# EAGLE design RFBee (EAGLE 5.07)
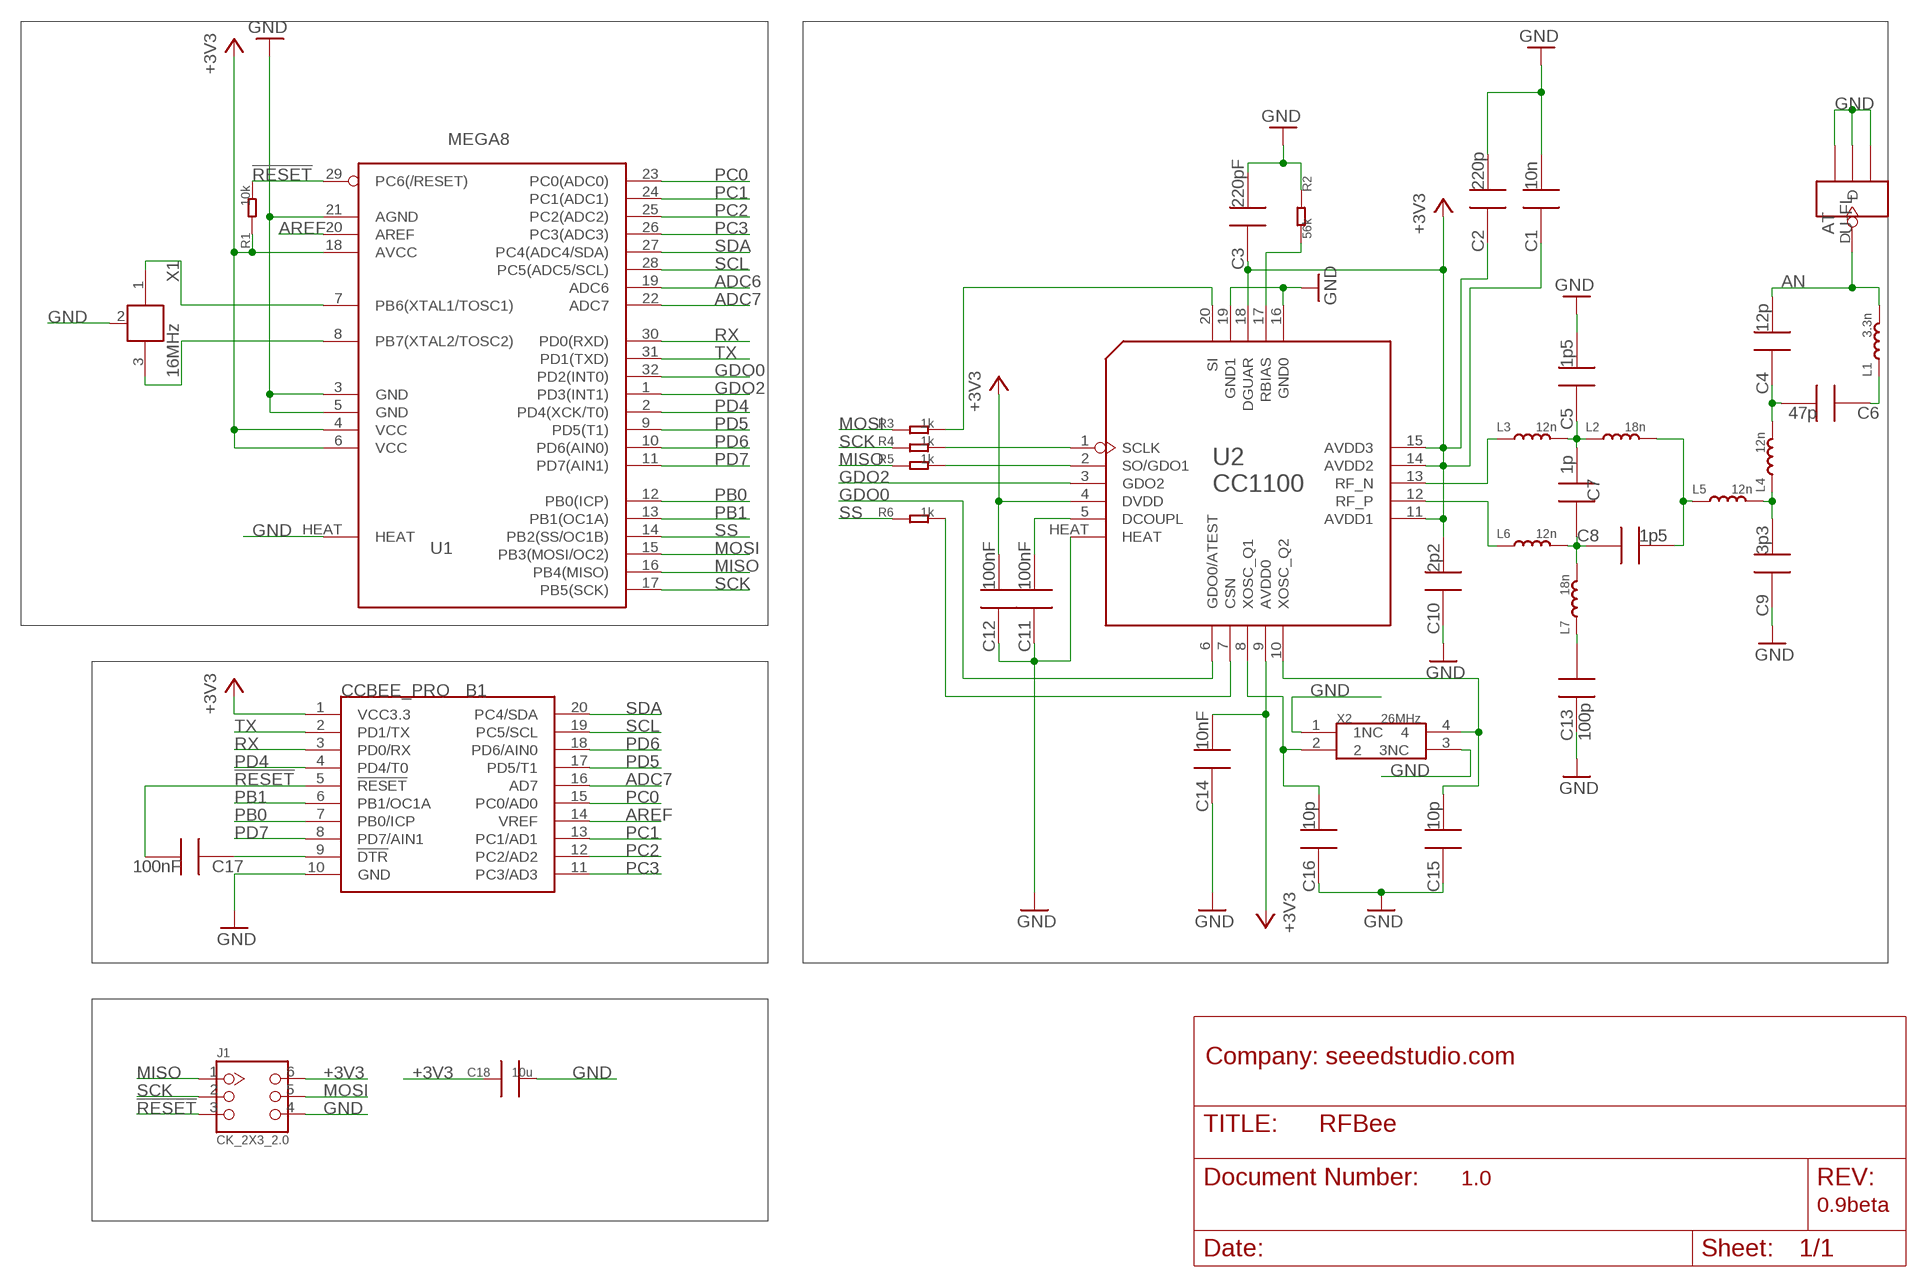
[diagram p0: schematic, sheet 1]

## Parts
AT  U-FL  [U-FL]
B1  CCBEE_PRO  [CCBEE-PRO]
C1  10n  C0603_S  [0603_S]
C2  220p  C0603_S  [0603_S]
C3  220pF  C0603_S  [0603_S]
C4  12p  C0603_S  [0603_S]
C5  1p5  C0603_S  [0603_S]
C6  47p  C0603_S  [0603_S]
C7  1p  C0603_S  [0603_S]
C8  1p5  C0603_S  [0603_S]
C9  3p3  C0603_S  [0603_S]
C10  2p2  C0603_S  [0603_S]
C11  100nF  C0603_S  [0603_S]
C12  100nF  C0603_S  [0603_S]
C13  100p  C0603_S  [0603_S]
C14  10nF  C0603_S  [0603_S]
C15  10p  C0603_S  [0603_S]
C16  10p  C0603_S  [0603_S]
C17  100nF  C0603_S  [0603_S]
C18  10u  C0805  [0805]
J1  CK_2X3_2.0  [CK_2X3_2.0]
L1  3.3n  L0603_S  [0603_S]
L2  18n  L0603_S  [0603_S]
L3  12n  L0603_S  [0603_S]
L4  12n  L0603_S  [0603_S]
L5  12n  L0603_S  [0603_S]
L6  12n  L0603_S  [0603_S]
L7  18n  L0603_S  [0603_S]
R1  10k  R0603_S  [0603_S]
R2  56k  R0603_S  [0603_S]
R3  1k  R0603_S  [0603_S]
R4  1k  R0603_S  [0603_S]
R5  1k  R0603_S  [0603_S]
R6  1k  R0603_S  [0603_S]
U1  MEGA8  [MLF32X]
U2  CC1100  [QFN20]
X1  16MHz  XTAL_NCVER  [XTAL_3X2]
X2  26MHz  XTAL_SMD_3225  [X3225]

## Nets
!RESET: B1.5(!RESET) C17.2 J1.3 R1.2 U1.29(PC6(/RESET))
+3V3: B1.1(VCC3.3) C1.1 C2.1 C3.1 C10.2 C12.2 C14.2 C18.1 J1.6 R1.1 U1.4(VCC) U1.6(VCC) U1.18(AVCC) U2.4(DVDD) U2.9(AVDD0) U2.11(AVDD1) U2.14(AVDD2) U2.15(AVDD3) U2.18(DGUAR)
ADC6: U1.19(ADC6)
ADC7: B1.16(AD7) U1.22(ADC7)
AN: AT.D C4.2 L1.2
AREF: B1.14(VREF) U1.20(AREF)
DTR: B1.9(!DTR) C17.1
GDO0: U1.32(PD2(INT0)) U2.6(GDO0/ATEST)
GDO2: U1.1(PD3(INT1)) U2.3(GDO2)
GND: AT.GND1 AT.GND2 AT.GND3 B1.10(GND) C1.2 C2.2 C3.2 C5.2 C9.1 C10.1 C11.1 C12.1 C13.1 C14.1 C15.1 C16.1 C18.2 J1.4 R2.1 U1.3(GND) U1.5(GND) U1.21(AGND) U1.HEAT U2.16(GND0) U2.19(GND1) U2.HEAT X1.2(GND) X2.1(1NC) X2.3(3NC)
MISO: J1.1 R5.1 U1.16(PB4(MISO))
MOSI: J1.5 R3.1 U1.15(PB3(MOSI/OC2))
N$1: C11.2 U2.5(DCOUPL)
N$2: C16.2 U2.8(XOSC_Q1) X2.2
N$3: R4.2 U2.1(SCLK)
N$4: L3.1 U2.13(RF_N)
N$5: L6.1 U2.12(RF_P)
N$6: C5.1 C7.2 L2.1 L3.2
N$7: C7.1 C8.1 L6.2 L7.2
N$8: C8.2 L2.2 L5.1
N$9: C9.2 L4.1 L5.2
N$10: C4.1 C6.2 L4.2
N$11: U1.7(PB6(XTAL1/TOSC1)) X1.1
N$12: C13.2 L7.1
N$13: U1.8(PB7(XTAL2/TOSC2)) X1.3
N$14: R3.2 U2.20(SI)
N$15: R2.2 U2.17(RBIAS)
N$16: C15.2 U2.10(XOSC_Q2) X2.4
N$17: R5.2 U2.2(SO/GDO1)
N$18: R6.2 U2.7(CSN)
N$21: C6.1 L1.1
PB0: B1.7(PB0/ICP) U1.12(PB0(ICP))
PB1: B1.6(PB1/OC1A) U1.13(PB1(OC1A))
PC0: B1.15(PC0/AD0) U1.23(PC0(ADC0))
PC1: B1.13(PC1/AD1) U1.24(PC1(ADC1))
PC2: B1.12(PC2/AD2) U1.25(PC2(ADC2))
PC3: B1.11(PC3/AD3) U1.26(PC3(ADC3))
PD4: B1.4(PD4/T0) U1.2(PD4(XCK/T0))
PD5: B1.17(PD5/T1) U1.9(PD5(T1))
PD6: B1.18(PD6/AIN0) U1.10(PD6(AIN0))
PD7: B1.8(PD7/AIN1) U1.11(PD7(AIN1))
RX: B1.3(PD0/RX) U1.30(PD0(RXD))
SCK: J1.2 R4.1 U1.17(PB5(SCK))
SCL: B1.19(PC5/SCL) U1.28(PC5(ADC5/SCL))
SDA: B1.20(PC4/SDA) U1.27(PC4(ADC4/SDA))
SS: R6.1 U1.14(PB2(SS/OC1B))
TX: B1.2(PD1/TX) U1.31(PD1(TXD))

## Notes on the sheet
- Company: seeedstudio.com
- 1.0
- 0.9beta

## Library data of the parts
AT = CPT_SMD:U-FL
B1 = EXT_moudle:CCBEE
C1-C17 = CPT_SMD:C0603
C18 = CPT_SMD:C0805
J1 = CONNECTER:CK_2X3
L1-L7 = CPT_SMD:L0603
R1-R6 = CPT_SMD:R0603
U1 = ICs_v54:MEGA8
U2 = Wireless_chips:CC1100
X1 = CPT_SMD:XTAL_NC
X2 = CPT_SMD:XTAL_SMD

## Board
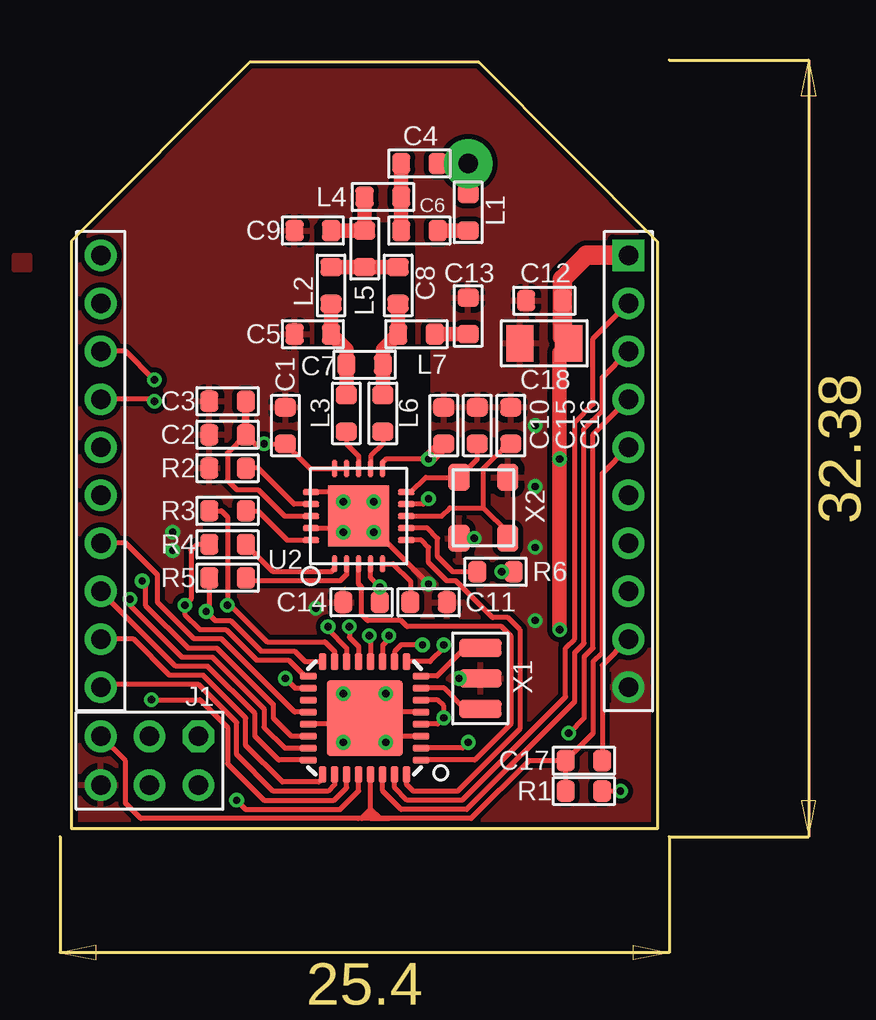
[diagram p1: board, top side]
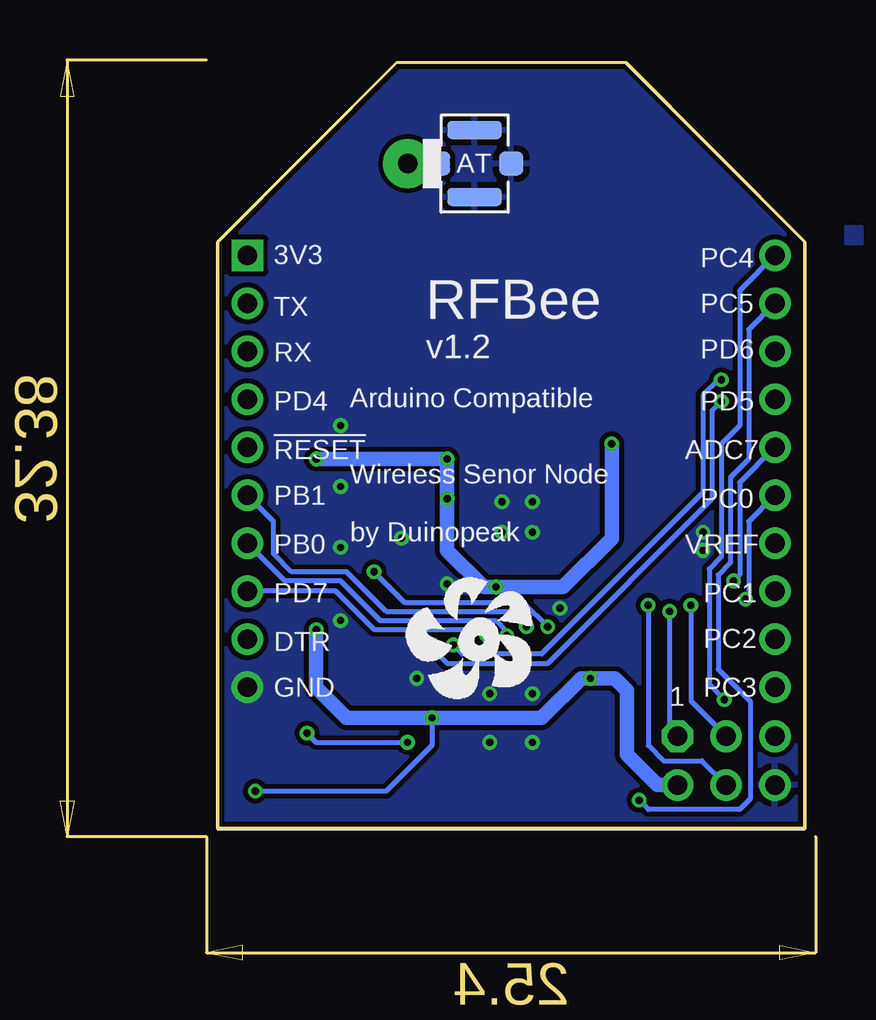
[diagram p2: board, bottom side, seen from below]

Size 24.45 x 31.94 mm. Coordinates in mm from the lower left corner, seen from the top.
Outline: 7.43,31.94 0,24.48 0,0 24.45,0 24.45,24.45 16.99,31.94 7.43,31.94
Copper layers (1*16): Top 0.035mm / dielectric 1.5mm / Bottom 0.035mm
Design rules "SeeedStudio_rule_no_angle_090911 *": minimum track width 6mil, minimum drill 12mil, track to track 6mil, track to pad 6mil, pad to pad 6mil, via to via 6mil, smd to smd 0mil, copper to edge 3mil, drill to drill 10mil, minimum pad ring 10mil, minimum via ring 6mil, stop-mask expansion 2mil, vias tented up to drill 30mil, thermal gap 10mil
tRestrict: area 9.4,1.8 to 15,7.4; area 9.7,11.1 to 14.8,20; area 10.3,20 to 14.1,25.1

### Footprints (pad centres in the part's own frame; a part is rotated, then mirrored left to right if it is on the bottom)
U-FL = smd 1.016 x 1.016: D -1.524,0; GND3 1.524,0 | smd 2.286 x 0.762: GND1 0,1.397; GND2 0,-1.397
CCBEE-PRO = drill 0.813 square: 1 -11,9 | drill 0.813: 2 -11,7; 3 -11,5; 4 -11,3; 5 -11,1; 6 -11,-1; 7 -11,-3; 8 -11,-5; 9 -11,-7; 10 -11,-9; 11 11,-9; 12 11,-7; 13 11,-5; 14 11,-3; 15 11,-1; 16 11,1; 17 11,3; 18 11,5; 19 11,7; 20 11,9
0603_S = smd 0.762 x 0.889: 1 -0.762,0; 2 0.762,0
0805 = smd 1.143 x 1.524: 1 -1.016,0; 2 1.016,0
CK_2X3_2.0 = drill 0.813 pad 1.27 octagon: 1 -1.016,2.032 | drill 0.813 pad 1.27: 2 -1.016,0; 3 -1.016,-2.032; 4 1.016,-2.032; 5 1.016,0; 6 1.016,2.032
MLF32X = smd 0.7 x 0.3: 1 -2.35,1.75; 2 -2.35,1.25; 3 -2.35,0.75; 4 -2.35,0.25; 5 -2.35,-0.25; 6 -2.35,-0.75; 7 -2.35,-1.25; 8 -2.35,-1.75; 17 2.35,-1.75; 18 2.35,-1.25; 19 2.35,-0.75; 20 2.35,-0.25; 21 2.35,0.25; 22 2.35,0.75; 23 2.35,1.25; 24 2.35,1.75 | smd 0.3 x 0.7: 9 -1.75,-2.35; 10 -1.25,-2.35; 11 -0.75,-2.35; 12 -0.25,-2.35; 13 0.25,-2.35; 14 0.75,-2.35; 15 1.25,-2.35; 16 1.75,-2.35; 25 1.75,2.35; 26 1.25,2.35; 27 0.75,2.35; 28 0.25,2.35; 29 -0.25,2.35; 30 -0.75,2.35; 31 -1.25,2.35; 32 -1.75,2.35 | smd 3.175 x 3.175: HEAT 0,0
QFN20 = smd 0.686 x 0.241: 1 -3.986,1.25; 2 -3.986,0.75; 3 -3.986,0.25; 4 -3.986,-0.25; 5 -3.986,-0.75; 11 -0.013,-0.75; 12 -0.013,-0.25; 13 -0.013,0.25; 14 -0.013,0.75; 15 -0.013,1.25 | smd 0.241 x 0.686: 6 -3,-1.736; 7 -2.5,-1.736; 8 -2,-1.736; 9 -1.5,-1.736; 10 -1,-1.736; 16 -1,2.236; 17 -1.5,2.236; 18 -2,2.236; 19 -2.5,2.236; 20 -3,2.236 | smd 2.54 x 2.54: HEAT -2,0.25
XTAL_3X2 = smd 0.762 x 1.778: 1 -1.27,0; 2 0,0; 3 1.27,0
X3225 = smd 1.143 x 0.889: 1 -1.27,1.016; 2 -1.27,-1.016; 3 1.27,-1.016; 4 1.27,1.016

### Placement (x,y rotation side)
AT  13.75,27.72 0 bottom
B1  12.22,14.89 0 bottom
C1  8.92,16.8 90 top
C2  6.51,16.41 180 top
C3  6.51,17.81 180 top
C4  14.51,27.72 0 top
C5  10.07,20.61 180 top
C6  14.51,24.92 180 top
C7  12.22,19.34 180 top
C8  13.62,22.64 90 top
C9  10.07,24.92 0 top
C10  15.53,16.8 270 top
C11  14.89,9.43 180 top
C12  19.72,22 0 top
C13  16.54,21.37 270 top
C14  12.1,9.43 0 top
C15  16.92,16.8 270 top
C16  18.32,16.8 270 top
C17  21.37,2.83 180 top
C18  19.72,20.23 180 top
J1  3.26,2.83 270 top
L1  16.54,25.69 90 top
L2  10.83,22.64 90 top
L3  11.46,17.3 90 top
L4  12.99,26.32 0 top
L5  12.22,24.16 90 top
L6  12.99,17.3 90 top
L7  14.38,20.61 180 top
R1  21.37,1.56 180 top
R2  6.51,15.02 0 top
R3  6.51,13.24 0 top
R4  6.51,11.84 0 top
R5  6.51,10.45 0 top
R6  17.69,10.7 180 top
U1  12.22,4.6 180 top
U2  12.22,15.02 90 top
U$1  [DUINOFUN-LOGO-PCB-0.7]  16.67,5.37 0 bottom
X1  17.05,6.26 90 top
X2  17.18,13.37 90 top

### Tracks (layer width: path | path; a pad name or v marks a point on that pad's centre or on a via)
!RESET
  Top 0.203: J1.3 2.25,2.81 2.25,1.05 2.89,0.41 12.48,0.41 | 12.48,0.41 12.47,0.42 | 11.97,0.41 12.1,0.41 12.48,0.79 | 12.48,0.79 12.48,0.67 | 12.48,0.67 12.35,0.54 12.61,0.54 12.48,0.41 | 12.48,0.41 12.86,0.41 | 12.86,0.41 13.24,0.41 | 12.86,0.41 12.48,0.79 | U1.29 12.47,0.67 12.48,0.67 | 12.48,0.41 16.67,0.41 19.08,2.83 C17.2 | B1.5 22.13,14.8 22.13,7.33 21.75,6.95 21.75,3.97 C17.2 | C17.2 R1.2
+3V3  (via drill 0.3)
  Top 0.203: U2.11 12.97,15.26 13.11,15.4 v14.89,15.4 | U2.18 8.89,13.02 7.78,14.13 6.89,14.13 6.51,14.51 6.51,15.65 C2.1 7.65,16.03 v8.03,16.03 C1.1 9.95,15.01 U2.15 U2.14 | U1.4 15.27,4.35 v15.53,4.61 15.53,5.1 15.27,5.35 U1.6 | U2.9 14.66,13.52 v14.89,13.75 | U2.4 12.47,10.45 v12.86,10.07 C14.2 | v22.89,1.56 R1.1 | U1.18 9.32,5.85 v8.92,6.26
  Top 0.305: C3.1 C2.1
  Top 0.61: 20.48,20.48 C18.1 20.35,19.84 20.35,15.27 | v14.89,15.4 C10.2 | v20.35,15.4 20.35,15.27 | 20.35,15.27 v20.35,8.29
  Top 0.813: B1.1 21.48,23.89 20.48,22.89 C12.2 20.48,20.48
  Bottom 0.203: v22.89,1.56 17.43,1.56 15.53,3.46 v15.53,4.61
  Bottom 0.61: v8.03,16.03 8.03,12.1 10.07,10.07 v12.86,10.07 13.37,10.07 14.89,11.59 v14.89,13.75 v14.89,15.4 v20.35,15.4 | J1.6 6.13,1.81 7.4,3.08 7.4,5.75 7.91,6.26 v8.92,6.26 9.3,6.26 10.95,4.6 v15.52,4.6 v15.53,4.61 v15.53,4.6 19.08,4.6 20.35,5.87 v20.35,8.29
  pour Top: -2.38,23.91 -1.75,23.91 -1.75,23.27 -2.38,23.27
ADC7  (via drill 0.3)
  Top 0.203: v2.95,10.32 3.08,10.19 3.08,9.3 4.86,7.53 6.06,7.53 8.41,5.18 8.41,4.6 9.16,3.85 U1.22
  Bottom 0.203: v2.95,10.32 2.7,10.57 2.7,14.42 B1.16
AN  (via drill 0.81 pad 2.03)
  Top 0.61: 15.53,27.72 AT.D | L1.2 16.54,26.57
  Top 0.813: 15.53,27.72 v16.54,27.72 16.54,26.57
  Bottom 1.016: v16.54,27.72 AT.D
AREF
  Top 0.203: B1.14 2.27,11.89 3.59,10.57 3.59,9.43 5.11,7.91 6.25,7.91 9.31,4.85 U1.20
DTR
  Top 0.203: B1.9 22.13,6.8 C17.1
GDO0
  Top 0.203: U2.6 14.59,12.02 14.89,11.72 14.89,11.08 15.65,10.32 16.03,10.32 17.56,8.79 18.19,8.79 18.7,8.29 18.7,4.16 16.1,1.56 14.26,1.56 13.97,1.84 U1.32
GDO2
  Top 0.203: U2.3 11.97,10.19 12.1,10.07 12.1,8.92 12.35,8.67 13.75,8.67 14,8.41 17.94,8.41 18.32,8.03 18.32,4.35 16.82,2.85 U1.1
GND  (via drill 0.3)
  Top 0.203: U2.19 11.47,12.52 | 11.47,12.52 U2.HEAT 10.97,14.02 U2.16 | v11.34,12.35 11.34,12.38 11.47,12.52 | U1.21 11.97,4.35 U1.HEAT | U1.5 12.47,4.85 U1.HEAT | U1.3 12.97,3.85 U1.HEAT | v13.11,3.59 13.11,3.71 U1.HEAT | v13.11,5.62 13.11,5.49 U1.HEAT | v14.89,10.19 12.73,12.35 v12.61,12.35
  other vias: 16.8,12.1 11.34,13.62 12.61,13.62 10.19,9.18 16.16,6.26 4.22,12.35 4.22,11.59 11.34,3.59 11.34,5.62 19.34,8.67 19.34,11.72 19.34,14.26 19.34,16.8
  pour Bottom: -2.38,25.05 -1.75,25.05 -1.75,24.42 -2.38,24.42
  pour Top (isolate 0.203, rank 6): -0.48,32.04 24.92,32.04 24.92,-0.35 -0.48,-0.35
  pour Bottom (isolate 0.203, rank 6): -0.48,32.04 24.92,32.04 24.92,-0.35 -0.48,-0.35
  pour Top (isolate 0.254, no thermals): 21.75,6.64 24.67,6.64 24.67,4.73 21.75,4.73
  pour Bottom (isolate 0.203, no thermals): 21.75,6.64 24.67,6.64 24.67,4.73 21.75,4.73
MISO  (via drill 0.3)
  Top 0.203: R5.1 5.75,9.18 v5.62,9.05 6,8.67 6.64,8.67 7.91,7.4 9.3,7.4 9.75,6.95 U1.16
  Bottom 0.203: J1.1 5.62,4.17 v5.62,9.05
MOSI  (via drill 0.3)
  Top 0.203: R3.1 6.25,13.24 6.51,12.99 v6.51,9.3 6.64,9.3 8.16,7.78 10.57,7.78 10.97,7.38 U1.15
  Bottom 0.203: J1.5 4.27,2.83 5.87,2.83 6.51,3.46 v6.51,9.3
N$1
  Top 0.203: U2.5 13.42,11.03 14.13,10.32 C11.2
N$2
  Top 0.203: U2.8 15.43,13.02 15.78,13.37 17.18,13.37 | X2.2 18.19,12.35 17.18,13.37 | C16.2 18.19,16.03 17.18,15.02 17.18,13.37
N$3
  Top 0.203: U2.1 10.97,10.85 10.83,10.7 8.41,10.7 R4.2
N$4
  Top 0.203: U2.13 11.97,15.52 11.46,16.03 L3.1
N$5
  Top 0.203: U2.12 12.47,15.52 12.99,16.03 L6.1
N$6
  Top 0.61: L3.2 C7.2 11.46,19.97 C5.1 L2.1
N$7
  Top 0.61: L6.2 C7.1 12.99,19.97 L7.2 C8.1
N$8
  Top 0.61: L2.2 L5.1 C8.2
N$9
  Top 0.61: C9.2 L5.2 L4.1
N$10
  Top 0.61: C6.2 L4.2 C4.1
N$11
  Top 0.203: U1.7 15.55,5.85 16.41,4.98 X1.1
N$12
  Top 0.61: C13.2 L7.1
N$13
  Top 0.203: U1.8 15.24,6.35 16.41,7.53 X1.3
N$14
  Top 0.203: U2.20 9,12.02 7.78,13.24 R3.2
N$15
  Top 0.203: U2.17 9.28,13.52 7.78,15.02 R2.2
N$16
  Top 0.203: C15.2 16.92,15.4 X2.4 14.76,14.64 14.14,14.02 U2.10
N$17
  Top 0.203: U2.2 11.47,10.59 11.21,10.32 7.4,10.32 R5.2
N$18
  Top 0.203: U2.7 14.85,12.52 15.27,12.1 15.27,11.34 15.91,10.7 R6.2
N$21
  Top 0.61: L1.1 C6.1
PB0  (via drill 0.3)
  Top 0.203: U1.12 12.47,7.97 v12.42,8.03
  Bottom 0.203: v12.42,8.03 12.42,8.22 12.86,8.67 17.69,8.67 19.34,10.32 21.65,10.32 B1.7
PB1  (via drill 0.3)
  Top 0.203: U1.13 11.97,7.58 11.59,7.97 v11.59,8.41
  Bottom 0.203: v11.59,8.41 12.22,9.05 17.43,9.05 19.08,10.7 21.37,10.7 22.13,11.46 22.13,12.8 B1.6
PC0  (via drill 0.3)
  Top 0.203: v2.45,9.56 2.45,9.3 4.6,7.14 5.87,7.14 8.03,4.98 8.03,4.22 8.9,3.35 U1.23
  Bottom 0.203: v2.45,9.56 2.32,9.68 2.32,12.8 B1.15
PC1
  Top 0.203: B1.13 4.35,6.76 5.68,6.76 7.65,4.79 7.65,3.84 8.64,2.85 U1.24
PC2
  Top 0.203: U1.25 10.47,2.09 10.32,1.94 8.79,1.94 7.27,3.46 7.27,4.6 5.49,6.38 4.1,6.38 2.59,7.89 B1.12
PC3
  Top 0.203: U1.26 10.97,1.83 10.7,1.56 8.41,1.56 6.89,3.08 6.89,4.41 5.3,6 1.33,6 B1.11
PD4  (via drill 0.3)
  Top 0.203: U1.2 16.31,3.35 v16.54,3.59 | B1.4 21.75,16.42 21.75,7.53 21.37,7.14 21.37,4.6 v20.73,3.97
  Bottom 0.203: v16.54,3.59 20.35,3.59 v20.73,3.97
PD5  (via drill 0.3)
  Top 0.203: B1.17 3.38,17.89 v3.46,17.81 | U1.9 14.96,6.95 15.53,7.53 v15.53,7.65
  Bottom 0.203: v3.46,17.81 3.84,17.43 3.84,13.75 10.7,6.89 14.89,6.89 15.53,7.53 v15.53,7.65
PD6  (via drill 0.3)
  Top 0.203: B1.18 2.27,19.89 v3.46,18.7 | U1.10 13.47,7.38 13.75,7.65 v14.64,7.65
  Bottom 0.203: v3.46,18.7 3.59,18.7 4.22,18.07 4.22,14 10.95,7.27 14.26,7.27 v14.64,7.65
PD7  (via drill 0.3)
  Top 0.203: U1.11 12.97,7.64 13.24,7.91 v13.24,8.03
  Bottom 0.203: v13.24,8.03 13.49,8.29 17.94,8.29 19.54,9.89 B1.8
RX
  Top 0.203: U1.30 12.97,1.57 13.75,0.79 16.48,0.79 20.99,5.3 20.99,7.33 21.37,7.71 21.37,16.67 22.13,17.43 22.13,18.8 B1.3
SCK  (via drill 0.3)
  Top 0.203: R4.1 5.24,11.84 4.99,11.59 4.99,9.56 v4.73,9.3 4.73,8.92 5.37,8.29 6.45,8.29 7.72,7.02 9.05,7.02 9.71,6.35 U1.17
  Bottom 0.203: J1.2 4.73,5.31 v4.73,9.3
SCL  (via drill 0.3)
  Top 0.203: U1.28 11.97,1.56 11.21,0.79 7.27,0.79 v6.89,1.18
  Bottom 0.203: B1.19 2.32,20.8 2.32,15.4 3.08,14.64 3.08,11.08 3.59,10.57 3.59,6.64 2.25,5.3 2.25,1.24 2.7,0.79 6.51,0.79 v6.89,1.18
SDA  (via drill 0.3)
  Top 0.203: U1.27 11.47,1.7 10.95,1.18 8.03,1.18 6.51,2.7 6.51,4.22 5.37,5.37 v3.33,5.37
  Bottom 0.203: v3.33,5.37 3.97,6 3.97,10.83 3.46,11.34 3.46,16.03 2.7,16.8 2.7,22.42 B1.20
SS  (via drill 0.3)
  Top 0.203: U1.14 11.47,7.51 10.7,8.29 v10.7,8.41 | R6.1 v17.94,10.7
  Bottom 0.203: v10.7,8.41 11.72,9.43 16.67,9.43 v17.94,10.7
TX
  Top 0.203: U1.31 13.47,1.7 14,1.18 16.29,1.18 20.61,5.49 20.61,7.53 20.99,7.91 20.99,16.92 21.75,17.68 21.75,20.42 B1.2

### Text on the board
bPlace: PC4 | 3V3 | PC5 | RFBee | TX | PD6 | v1.2 | RX | PD5 | Arduino Compatible | PD4 | ADC7 | !RESET | Wireless Senor Node | PB1 | PC0 | VREF | by Duinopeak | PB0 | PC1 | PD7 | PC2 | DTR | PC3 | GND | 1